# EAGLE board proxmark3 (EAGLE 6.4), part 1 of 2
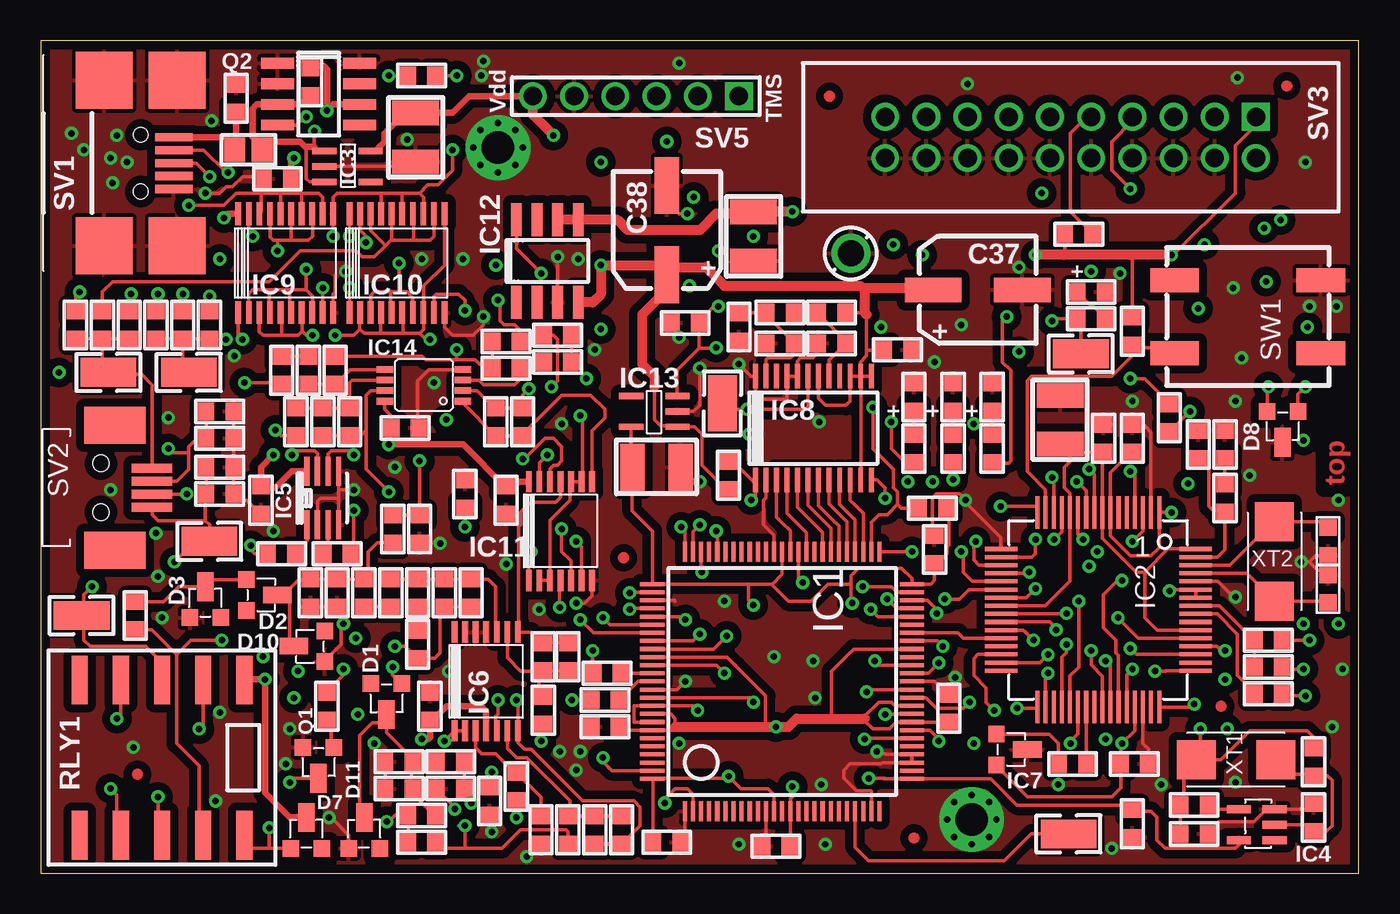
[diagram p5: board, top side]
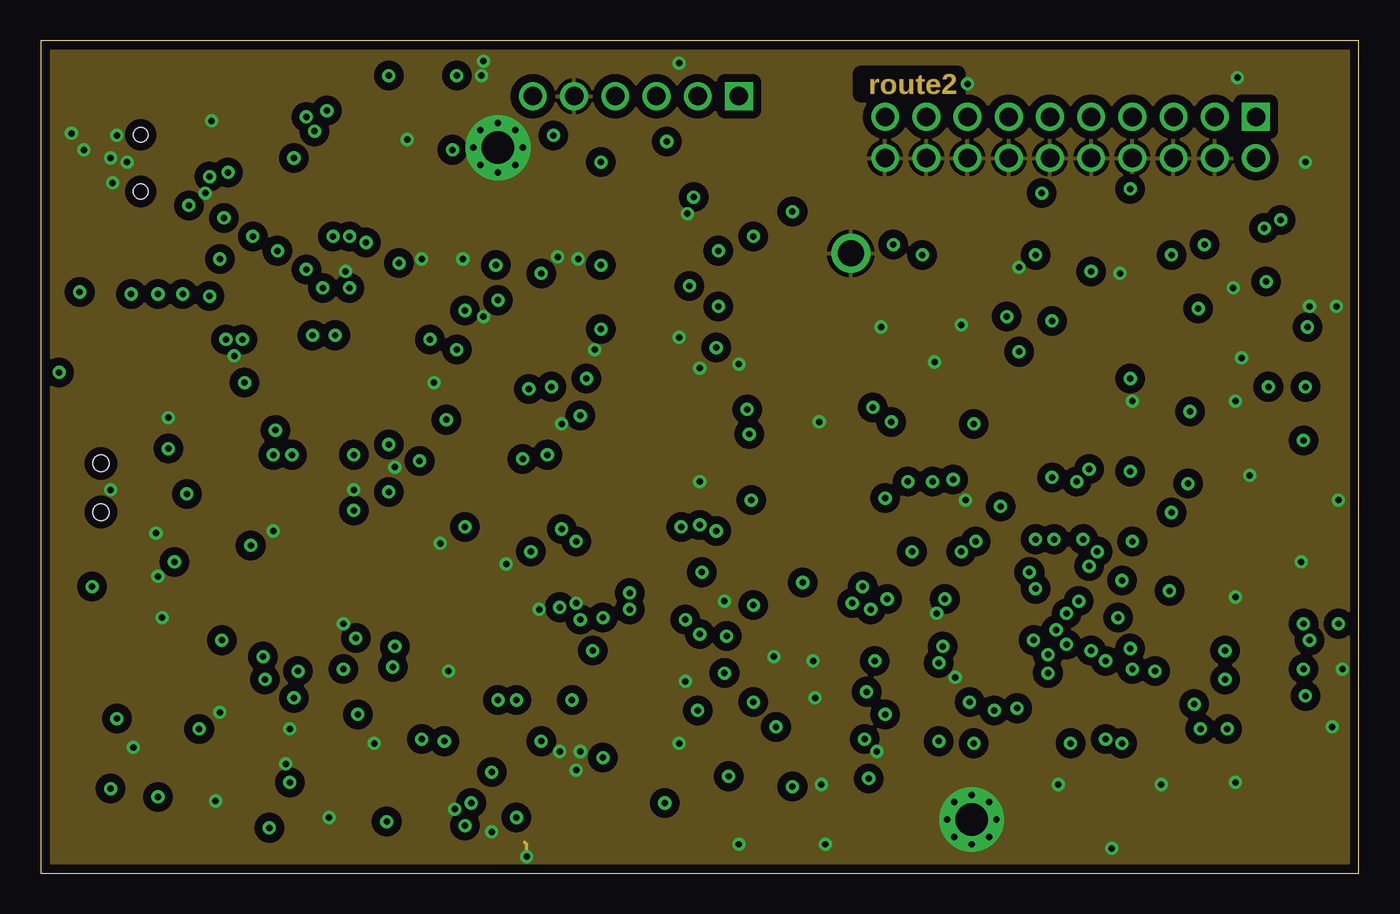
[diagram p6: board, inner layer Route2]
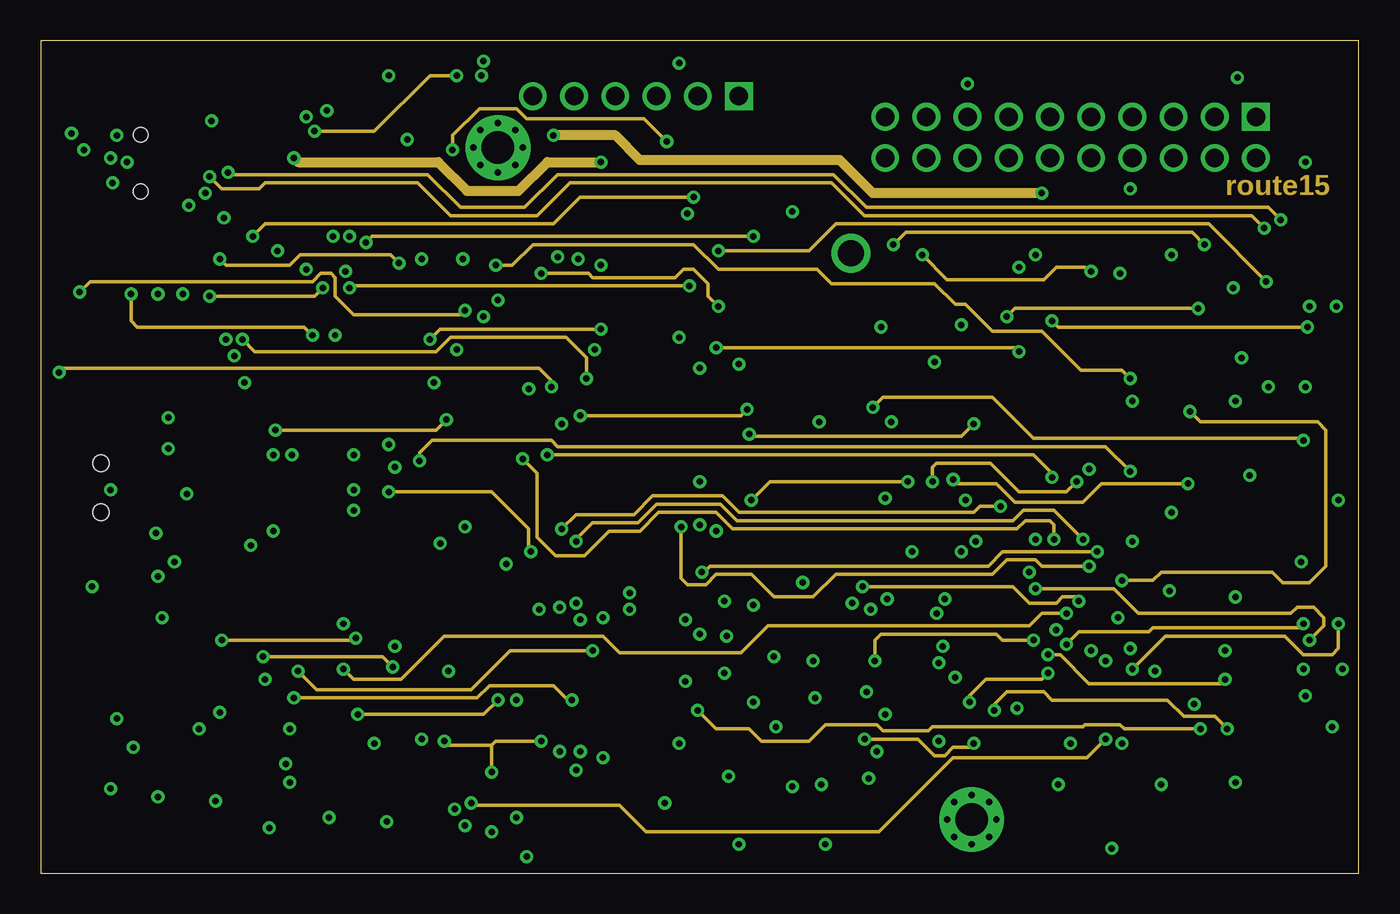
[diagram p7: board, inner layer Route15]
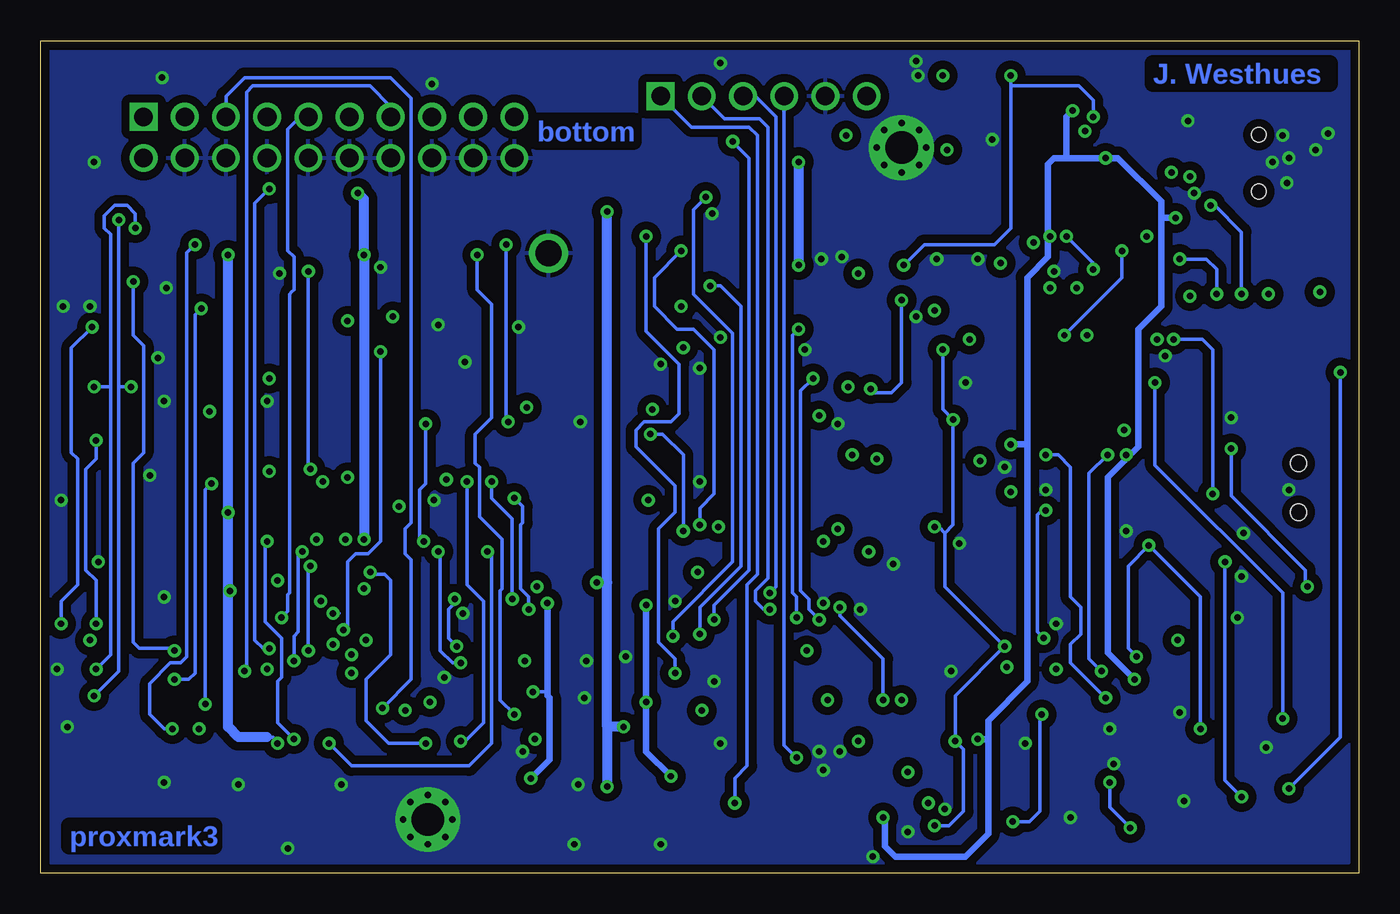
[diagram p8: board, bottom side, seen from below]

Size 81.28 x 51.31 mm. Coordinates in mm from the lower left corner, seen from the top.
Outline: 81.28,0 81.28,51.31 0,51.31 0,0 81.28,0
Copper layers (1*2*15*16): Top 1mil / dielectric 20mil / Route2 1mil / dielectric 20mil / Route15 1mil / dielectric 20mil / Bottom 1mil
Design rules "default *": minimum track width 8mil, minimum drill 0.4mm, track to track 8mil, track to pad 8mil, pad to pad 8mil, via to via 8mil, smd to smd 0mil, copper to edge 10mil, drill to drill 8mil, minimum pad ring 10mil, minimum via ring 8mil, stop-mask expansion 2mil, vias tented up to drill 16mil, thermal gap 10mil

## Footprints (pad centres in the part's own frame; a part is rotated, then mirrored left to right if it is on the bottom)
RLC_0603 = smd 1 x 1.1: 1 -0.85,0; 2 0.85,0
--MERGED_RLC_0603 = smd 1 x 1.1: 1 -0.85,0; 2 0.85,0
RLC_1210 = smd 1.5 x 2.9: 1 -1.5,0; 2 1.5,0
CAPCAITOR-ELECTROLYTIC-ALCHIP-MZA-F80 = smd 3.5 x 1.5: + 2.75,0; - -2.75,0
--MERGED_SOT23-3LEAD = smd 1.016 x 1.016: 1 -0.94,-0.762; 2 0.965,-0.762 | smd 1.016 x 1.778: 3 0.013,1.143
LED_0603 = smd 1 x 1.1: + -0.85,0; - 0.85,0
VQFP-100 = smd 1.25 x 0.25: 1 -8,6; 2 -8,5.5; 3 -8,5; 4 -8,4.5; 5 -8,4; 6 -8,3.5; 7 -8,3; 8 -8,2.5; 9 -8,2; 10 -8,1.5; 11 -8,1; 12 -8,0.5; 13 -8,0; 14 -8,-0.5; 15 -8,-1; 16 -8,-1.5; 17 -8,-2; 18 -8,-2.5; 19 -8,-3; 20 -8,-3.5; 21 -8,-4; 22 -8,-4.5; 23 -8,-5; 24 -8,-5.5; 25 -8,-6; 51 8,-6; 52 8,-5.5; 53 8,-5; 54 8,-4.5; 55 8,-4; 56 8,-3.5; 57 8,-3; 58 8,-2.5; 59 8,-2; 60 8,-1.5; 61 8,-1; 62 8,-0.5; 63 8,0; 64 8,0.5; 65 8,1; 66 8,1.5; 67 8,2; 68 8,2.5; 69 8,3; 70 8,3.5; 71 8,4; 72 8,4.5; 73 8,5; 74 8,5.5; 75 8,6 | smd 0.25 x 1.5: 26 -6,-8; 27 -5.5,-8; 28 -5,-8; 29 -4.5,-8; 30 -4,-8; 31 -3.5,-8; 32 -3,-8; 33 -2.5,-8; 34 -2,-8; 35 -1.5,-8; 36 -1,-8; 37 -0.5,-8; 38 0,-8; 39 0.5,-8; 40 1,-8; 41 1.5,-8; 42 2,-8; 43 2.5,-8; 44 3,-8; 45 3.5,-8; 46 4,-8; 47 4.5,-8; 48 5,-8; 49 5.5,-8; 50 6,-8; 76 6,8; 77 5.5,8; 78 5,8; 79 4.5,8; 80 4,8; 81 3.5,8; 82 3,8; 83 2.5,8; 84 2,8; 85 1.5,8; 86 1,8; 87 0.5,8; 88 0,8; 89 -0.5,8; 90 -1,8; 91 -1.5,8; 92 -2,8; 93 -2.5,8; 94 -3,8; 95 -3.5,8; 96 -4,8; 97 -4.5,8; 98 -5,8; 99 -5.5,8; 100 -6,8
LQFP-64 = smd 0.25 x 2: 1 0,0; 2 0.5,0; 3 1,0; 4 1.5,0; 5 2,0; 6 2.5,0; 7 3,0; 8 3.5,0; 9 4,0; 10 4.5,0; 11 5,0; 12 5.5,0; 13 6,0; 14 6.5,0; 15 7,0; 16 7.5,0; 33 7.5,12; 34 7,12; 35 6.5,12; 36 6,12; 37 5.5,12; 38 5,12; 39 4.5,12; 40 4,12; 41 3.5,12; 42 3,12; 43 2.5,12; 44 2,12; 45 1.5,12; 46 1,12; 47 0.5,12; 48 0,12 | smd 2 x 0.25: 17 9.75,2.25; 18 9.75,2.75; 19 9.75,3.25; 20 9.75,3.75; 21 9.75,4.25; 22 9.75,4.75; 23 9.75,5.25; 24 9.75,5.75; 25 9.75,6.25; 26 9.75,6.75; 27 9.75,7.25; 28 9.75,7.75; 29 9.75,8.25; 30 9.75,8.75; 31 9.75,9.25; 32 9.75,9.75; 49 -2.25,9.75; 50 -2.25,9.25; 51 -2.25,8.75; 52 -2.25,8.25; 53 -2.25,7.75; 54 -2.25,7.25; 55 -2.25,6.75; 56 -2.25,6.25; 57 -2.25,5.75; 58 -2.25,5.25; 59 -2.25,4.75; 60 -2.25,4.25; 61 -2.25,3.75; 62 -2.25,3.25; 63 -2.25,2.75; 64 -2.25,2.25
--MERGED_SOT-23-5 = smd 0.4 x 1.5: 1 -0.94,-1.422; 2 0.01,-1.422; 3 0.96,-1.422; 4 0.96,1.428; 5 -0.94,1.428
SMV-5 = smd 1.5 x 0.5: 1 0,0; 2 0,-0.95; 3 0,-1.9; 4 2.2,-1.9; 5 2.2,0
SOT-23-8-OR-MSOP-8 = smd 0.325 x 1.8: 1 -0.975,-1.65; 2 -0.325,-1.65; 3 0.325,-1.65; 4 0.975,-1.65; 5 0.975,1.65; 6 0.325,1.65; 7 -0.325,1.65; 8 -0.975,1.65
TSSOP-14 = smd 1.3 x 0.36: 1 0,0; 2 0,-0.65; 3 0,-1.3; 4 0,-1.95; 5 0,-2.6; 6 0,-3.25; 7 0,-3.9; 8 6.095,-3.9; 9 6.095,-3.25; 10 6.095,-2.6; 11 6.095,-1.95; 12 6.095,-1.3; 13 6.095,-0.65; 14 6.095,0
TSSOP-24 = smd 0.3 x 1.5: 1 -2.925,-3.2; 2 -2.275,-3.2; 3 -1.625,-3.2; 4 -0.975,-3.2; 5 -0.325,-3.2; 6 0.325,-3.2; 7 0.975,-3.2; 8 1.625,-3.2; 9 2.275,-3.2; 10 2.925,-3.2; 11 3.575,-3.2; 12 4.225,-3.2; 13 4.225,3.2; 14 3.575,3.2; 15 2.925,3.2; 16 2.275,3.2; 17 1.625,3.2; 18 0.975,3.2; 19 0.325,3.2; 20 -0.325,3.2; 21 -0.975,3.2; 22 -1.625,3.2; 23 -2.275,3.2; 24 -2.925,3.2
TSSOP-20 = smd 1.4 x 0.36: 1 0,0; 2 0,-0.65; 3 0,-1.3; 4 0,-1.95; 5 0,-2.6; 6 0,-3.25; 7 0,-3.9; 8 0,-4.55; 9 0,-5.2; 10 0,-5.85; 11 6.095,-5.85; 12 6.095,-5.2; 13 6.095,-4.55; 14 6.095,-3.9; 15 6.095,-3.25; 16 6.095,-2.6; 17 6.095,-1.95; 18 6.095,-1.3; 19 6.095,-0.65; 20 6.095,0
SOIC-8 = smd 0.66 x 2.032: 1 0,0; 2 1.27,0; 3 2.54,0; 4 3.81,0; 5 3.81,5.08; 6 2.54,5.08; 7 1.27,5.08; 8 0,5.08
MSOP8 = smd 0.41 x 1.02: 1 0,0; 2 0.65,0; 3 1.3,0; 4 1.95,0; 5 1.95,4.8; 6 1.3,4.8; 7 0.65,4.8; 8 0,4.8
--MERGED_TQ-SMD-RELAY = smd 1 x 3: 1 -5.08,-4.78; 2 -2.54,-4.78; 3 0,-4.78; 4 2.54,-4.78; 5 5.08,-4.78; 6 5.08,4.78; 7 2.54,4.78; 8 0,4.78; 9 -2.54,4.78; 10 -5.08,4.78
USB-MINIB-SMD = smd 2.3 x 0.5: 1 2,0.4; 2 2,-0.4; 3 2,-1.2; 4 2,-2; 5 2,-2.8 | smd 3.5 x 3.5: TAB0 -2.3,3.9; TAB1 2.2,3.9; TAB2 2.2,-6.3; TAB3 -2.3,-6.3 | hole 0.9: -0.05,0.55; -0.05,-2.95
HIROSE-MQ172-4POS = smd 0.55 x 2.5: 1 -1.2,6.75; 2 -0.4,6.75; 3 0.4,6.75; 4 1.2,6.75 | smd 2.3 x 3.8: P$1 -3.85,4.45; P$2 3.85,4.45 | hole 1: -1.5,3.6; 1.5,3.6
HEADER-MALE-10X2-0.100-SHROUDED = drill 1.143 square: 1 -1.27,11.43 | drill 1.143: 2 1.27,11.43; 3 -1.27,8.89; 4 1.27,8.89; 5 -1.27,6.35; 6 1.27,6.35; 7 -1.27,3.81; 8 1.27,3.81; 9 -1.27,1.27; 10 1.27,1.27; 11 -1.27,-1.27; 12 1.27,-1.27; 13 -1.27,-3.81; 14 1.27,-3.81; 15 -1.27,-6.35; 16 1.27,-6.35; 17 -1.27,-8.89; 18 1.27,-8.89; 19 -1.27,-11.43; 20 1.27,-11.43
--MERGED_HEADER-MALE-6X1-0.100-UNKEYED = drill 1.143 square: 1 0,6.35 | drill 1.143: 2 0,3.81; 3 0,1.27; 4 0,-1.27; 5 0,-3.81; 6 0,-6.35
TACTSWITCH-SMD-EVQQ1 = smd 1.5 x 3: A -2.25,4.5; B 2.25,-4.5; P$2 2.25,4.5; P$3 -2.25,-4.5
KEYSTONE-SMD-TESTPOINT-5015 = smd 3.429 x 1.778: 1 0,0
KEYSTONE-PTH-TESTPOINT-5011 = drill 1.6: A 0,0
RLC_0805 = smd 1.3 x 1.5: 1 -0.85,0; 2 0.85,0
XTAL-SMD-CITIZEN-CS10 = smd 2.4 x 2.4: A -0.2,0; B 4.7,0

## Placement (x,y rotation side)
C1  33n  [RLC_0603]  12.06,47.75 90 top
C2  22p  [RLC_0603]  78.49,3.43 90 top
C3  22p  [RLC_0603]  71.12,2.41 0 top
C4  33n  [RLC_0603]  73.03,26.42 270 top
C5  2n  [RLC_0603]  71.37,26.42 270 top
C6  22p  [--MERGED_RLC_0603]  79.38,17.53 270 top
C7  22p  [--MERGED_RLC_0603]  79.38,20.45 90 top
C8  1n  [RLC_0603]  65.53,26.8 90 top
C9  2u2  [RLC_1210]  62.87,27.94 90 top
C10  100n  [RLC_0603]  27.69,4.45 270 top
C11  1n  [RLC_0603]  22.1,6.86 180 top
C12  1n  [RLC_0603]  23.5,3.56 180 top
C13  dnp  [RLC_0603]  35.81,2.67 270 top
C14  22p  [RLC_0603]  5.84,15.88 90 top
C15  130p  [RLC_0603]  16.64,17.27 270 top
C16  1n  [RLC_0603]  21.59,17.27 90 top
C17  dnp  [RLC_0603]  32.51,13.34 90 top
C18  33n  [RLC_0603]  45.59,32.64 180 top
C19  33n  [RLC_0603]  48.77,32.64 180 top
C20  dnp  [RLC_0603]  11.05,28.45 0 top
C21  33n  [RLC_0603]  24,10.29 90 top
C22  33n  [RLC_0603]  22.48,27.43 0 top
C23  33n  [RLC_0603]  13.59,22.99 270 top
C24  33n  [RLC_0603]  28.7,22.99 270 top
C25  33n  [RLC_0603]  67.44,6.73 0 top
C26  33n  [RLC_0603]  67.31,26.8 90 top
C27  4u7  [RLC_1210]  23.11,45.34 270 top
C28  33n  [RLC_0603]  38.61,1.91 0 top
C29  33n  [RLC_0603]  34.8,9.02 180 top
C30  33n  [RLC_0603]  45.34,1.65 180 top
C31  33n  [RLC_0603]  56.01,10.16 90 top
C32  33n  [RLC_0603]  55.12,19.94 90 top
C33  4u7  [RLC_1210]  43.94,39.24 270 top
C34  4u7  [RLC_1210]  37.97,25.02 0 top
C35  47p  [RLC_0603]  11.05,25.02 0 top
C36  dnp  [RLC_0603]  11.05,23.37 0 top
C37  100u  [CAPCAITOR-ELECTROLYTIC-ALCHIP-MZA-F80]  57.78,35.94 180 top
C38  100u  [CAPCAITOR-ELECTROLYTIC-ALCHIP-MZA-F80]  38.61,39.62 270 top
C39  1n  [RLC_0603]  11.05,26.8 0 top
C40  dnp  [RLC_0603]  29.72,27.81 270 top
C41  dnp  [RLC_0603]  19.05,27.81 270 top
C42  1n  [RLC_0603]  31.88,33.15 0 top
C43  1n  [RLC_0603]  14.86,30.99 90 top
C44  33n  [RLC_0603]  52.83,32.26 0 top
C45  100n  [RLC_0603]  26.16,23.37 90 top
C46  33n  [RLC_0603]  14.61,42.8 180 top
C47  33n  [RLC_0603]  67.31,3.05 270 top
D1  --MERGED_DIODE-SMD-SOT23  [--MERGED_SOT23-3LEAD]  21.34,10.92 180 top
D2  --MERGED_DIODE-SMD-SOT23  [--MERGED_SOT23-3LEAD]  13.46,17.14 270 top
D3  --MERGED_DIODE-SMD-SOT23  [--MERGED_SOT23-3LEAD]  10.16,16.51 0 top
D4  LED  [LED_0603]  56.26,29.34 90 top
D5  LED  [LED_0603]  58.67,29.34 90 top
D6  LED  [LED_0603]  53.85,29.34 90 top
D7  --MERGED_DIODE-SMD-SOT23  [--MERGED_SOT23-3LEAD]  16.38,2.29 0 top
D8  --MERGED_DUAL-TVS-COMMON-ANODE  [--MERGED_SOT23-3LEAD]  76.58,27.69 180 top
D9  LED  [LED_0603]  64.77,35.81 0 top
D10  --MERGED_DIODE-SMD-SOT23  [--MERGED_SOT23-3LEAD]  16.76,13.97 90 top
D11  --MERGED_DIODE-SMD-SOT23  [--MERGED_SOT23-3LEAD]  19.94,2.29 0 top
IC1  SPARTAN-II-XC2S30-100-VQFP  [VQFP-100]  45.72,11.81 90 top
IC2  AT91SAM7S64  [LQFP-64]  68.96,22.23 180 top
IC3  --MERGED_PQ1X331M2ZP-3V3-LDO-SOT-23-5  [--MERGED_SOT-23-5]  18.92,43.56 270 top
IC4  HCU-INVERTER  [SMV-5]  76.07,2.03 180 top
IC5  TLV3502  [SOT-23-8-OR-MSOP-8]  17.4,23.11 0 top
IC6  MCP6294  [TSSOP-14]  25.53,8.76 90 top
IC7  --MERGED_MCP100  [--MERGED_SOT23-3LEAD]  59.69,7.62 270 top
IC8  TLC5540  [TSSOP-24]  46.99,27.43 0 top
IC9  74XX244-OCTAL-TRISTATE-BUFFERS  [TSSOP-20]  12.19,34.54 90 top
IC10  74XX244-OCTAL-TRISTATE-BUFFERS  [TSSOP-20]  19.05,34.54 90 top
IC11  CD4066  [TSSOP-14]  30.1,18.03 90 top
IC12  LP2989AIM-2.5  [SOIC-8]  29.34,35.18 0 top
IC13  --MERGED_PQ1X331M2ZP-3V3-LDO-SOT-23-5  [--MERGED_SOT-23-5]  37.85,28.45 90 top
IC14  AD8052  [MSOP8]  26.04,29.08 90 top
Q1  --MERGED_NPN-SOT23-2N3904  [--MERGED_SOT23-3LEAD]  17.14,6.99 180 top
Q2  IRF7307  [SOIC-8]  14.61,49.91 270 top
R1  1meg  [RLC_0603]  78.49,6.86 90 top
R2  100  [RLC_0603]  71.12,4.19 180 top
R3  330  [RLC_0603]  73.03,23.11 270 top
R4  27  [RLC_0603]  75.69,11.05 180 top
R5  27  [RLC_0603]  75.69,12.7 180 top
R6  1k5  [RLC_0603]  75.69,14.35 0 top
R7  10k  [RLC_0603]  64.01,39.37 180 top
R8  10k  [RLC_0603]  63.63,6.73 0 top
R9  100k  [RLC_0603]  29.34,5.33 270 top
R10  100k  [RLC_0603]  30.86,2.67 90 top
R11  510k  [RLC_0603]  22.1,5.21 0 top
R12  100k  [RLC_0603]  23.5,1.91 180 top
R13  10k  [RLC_0603]  32.51,2.67 90 top
R14  10k  [RLC_0603]  34.16,2.67 270 top
R15  10k  [RLC_0603]  18.29,17.27 90 top
R16  zerohm  [RLC_0603]  19.94,17.27 270 top
R17  10k  [RLC_0603]  24.89,17.27 90 top
R18  10k  [RLC_0603]  30.99,13.34 90 top
R19  10k  [RLC_0603]  30.99,10.03 90 top
R20  240k  [RLC_0603]  14.86,19.68 0 top
R21  24k  [RLC_0603]  18.29,19.68 180 top
R22  33  [RLC_0603]  5.46,33.78 270 top
R23  1k  [RLC_0603]  39.75,33.91 0 top
R24  330  [RLC_0603]  56.26,26.16 90 top
R25  330  [RLC_0603]  58.67,26.16 90 top
R26  330  [RLC_0603]  53.85,26.16 90 top
R27  33  [RLC_0603]  7.11,33.78 270 top
R28  33  [RLC_0603]  3.81,33.78 270 top
R29  33  [RLC_0603]  8.76,33.78 270 top
R30  10meg  [RLC_0603]  25.27,6.86 0 top
R31  240k  [RLC_0603]  25.27,5.21 0 top
R32  zerohm  [RLC_0603]  16.51,30.99 270 top
R33  2k4  [RLC_0603]  28.07,27.81 270 top
R34  10k  [RLC_0603]  17.4,27.81 270 top
R35  zerohm  [RLC_0603]  31.88,31.5 180 top
R36  dnp  [RLC_0603]  26.54,17.27 90 top
R37  dnp  [RLC_0603]  23.24,17.27 90 top
R38  dnp  [RLC_0603]  23.24,14.1 90 top
R39  1k  [RLC_0603]  34.92,12.32 0 top
R40  10k  [RLC_0603]  17.65,10.29 270 top
R41  10meg  [RLC_0603]  21.72,21.21 90 top
R42  1meg  [RLC_0603]  23.37,21.21 90 top
R43  1k  [RLC_0603]  67.31,33.4 90 top
R44  1k  [RLC_0603]  34.8,10.67 0 top
R45  10k  [RLC_0603]  10.41,33.78 270 top
R46  10k  [RLC_0603]  2.16,33.78 270 top
R47  10k  [RLC_0603]  42.42,24.51 90 top
R48  dnp  [RLC_0603]  18.16,30.99 270 top
R49  2k4  [RLC_0603]  28.7,31.11 0 top
R50  10k  [RLC_0603]  15.75,27.81 90 top
R51  2k4  [RLC_0603]  28.7,32.77 0 top
R52  100  [RLC_0603]  48.77,34.54 0 top
R53  330  [RLC_0603]  45.59,34.54 0 top
R54  100  [RLC_0603]  43.05,33.66 90 top
R55  330  [RLC_0603]  64.77,34.16 0 top
R56  10k  [RLC_0603]  23.5,49.15 0 top
R57  10k  [RLC_0603]  69.6,28.07 90 top
R58  dnp  [RLC_0603]  16.64,48.77 270 top
R59  3k3  [RLC_0603]  54.99,22.48 0 top
RLY1  --MERGED_RELAY-DPDT  [--MERGED_TQ-SMD-RELAY]  7.49,7.11 180 top
SV1  USB-MINIB  [USB-MINIB-SMD]  6.22,44.96 0 top
SV2  HIROSE-MQ172-4POS  [HIROSE-MQ172-4POS]  0.13,23.75 270 top
SV3  [HEADER-MALE-10X2-0.100-SHROUDED]  63.5,45.34 270 top
SV5  --MERGED_HEADER-MALE-6X1  [--MERGED_HEADER-MALE-6X1-0.100-UNKEYED]  36.7,47.88 270 top
SW1  TACTSWITCH  [TACTSWITCH-SMD-EVQQ1]  74.42,34.29 270 top
TP1  TESTPADKEYSTONE-SMD  [KEYSTONE-SMD-TESTPOINT-5015]  42.04,28.96 90 top
TP2  TESTPADKEYSTONE-SMD  [KEYSTONE-SMD-TESTPOINT-5015]  2.54,15.88 180 top
TP3  TESTPADKEYSTONE-SMD  [KEYSTONE-SMD-TESTPOINT-5015]  10.41,20.45 180 top
TP4  TESTPADKEYSTONE-SMD  [KEYSTONE-SMD-TESTPOINT-5015]  9.14,30.86 180 top
TP5  TESTPADKEYSTONE-SMD  [KEYSTONE-SMD-TESTPOINT-5015]  4.19,30.86 180 top
TP6  TESTPADKEYSTONE-PTH  [KEYSTONE-PTH-TESTPOINT-5011]  49.95,38.19 45 top
TP7  TESTPADKEYSTONE-SMD  [KEYSTONE-SMD-TESTPOINT-5015]  63.37,2.41 180 top
TP8  TESTPADKEYSTONE-SMD  [KEYSTONE-SMD-TESTPOINT-5015]  64.14,32 180 top
U1  FERRITE0805  [RLC_0805]  12.83,44.58 0 top
XT1  XTAL-SMD-CITIZEN-CS10  [XTAL-SMD-CITIZEN-CS10]  75.95,6.99 180 top
XT2  XTAL-SMD-CITIZEN-CS10  [XTAL-SMD-CITIZEN-CS10]  76.07,21.46 270 top